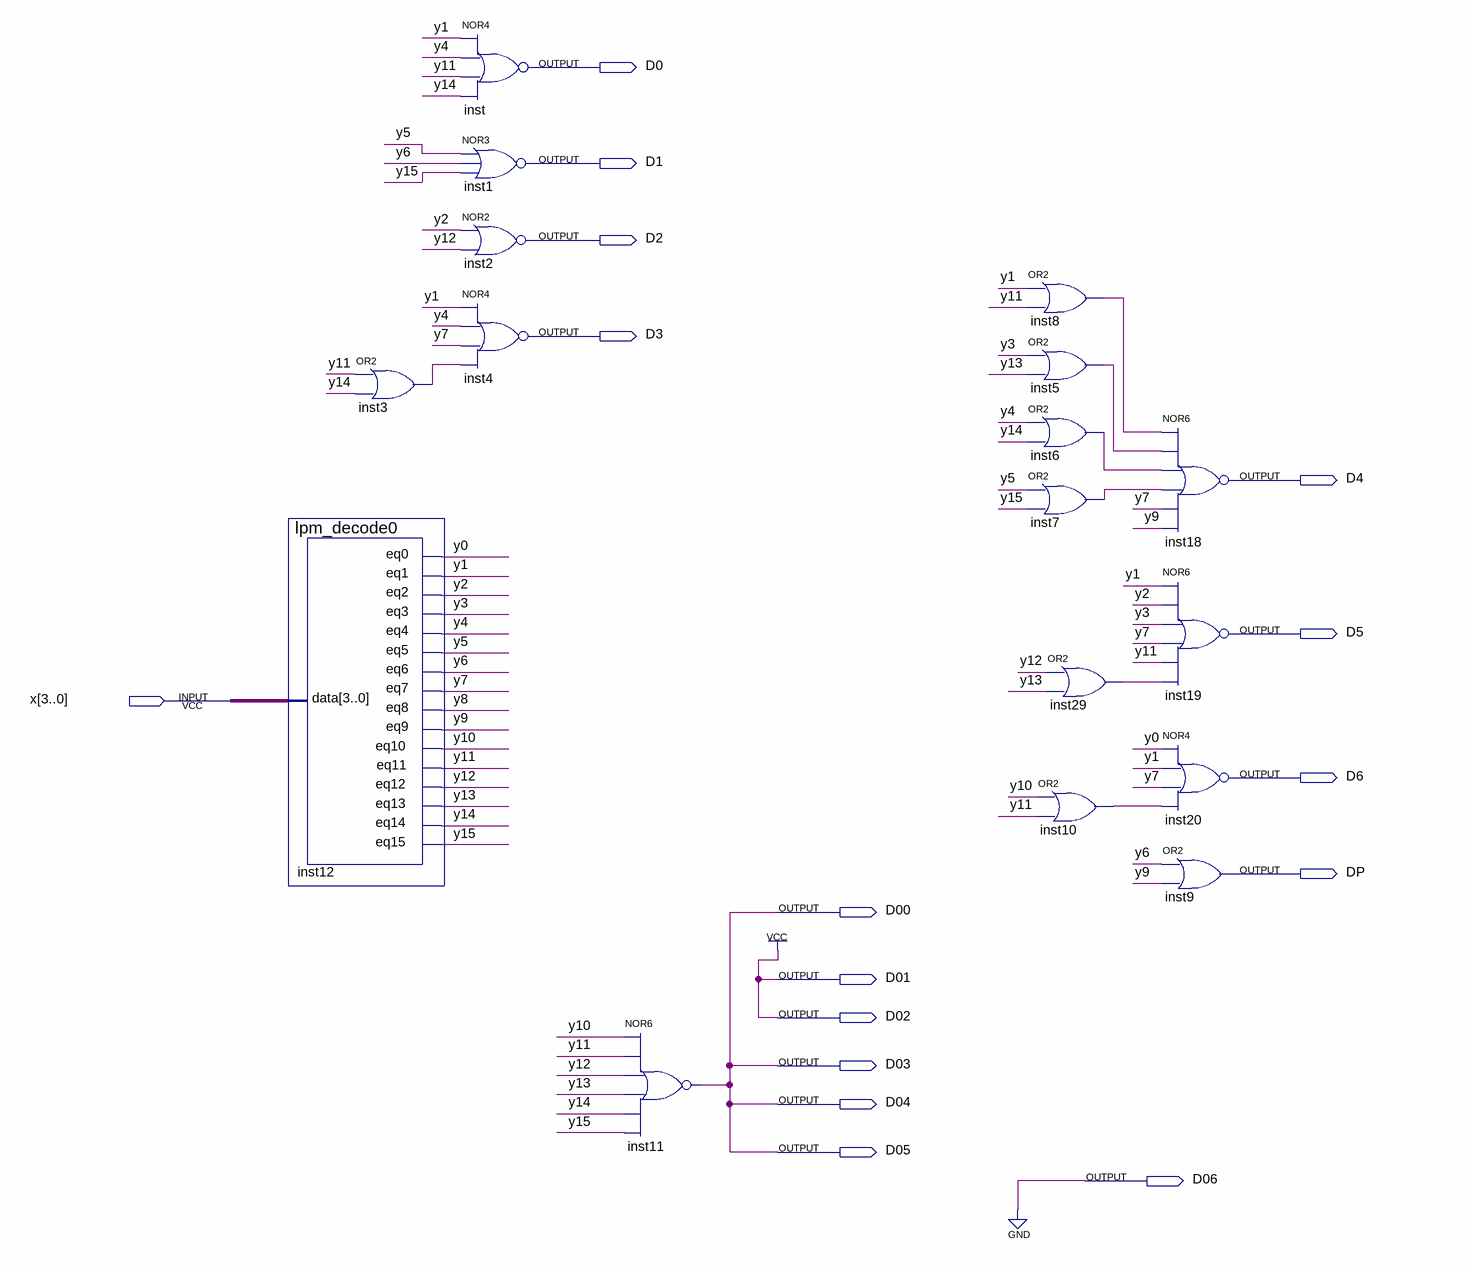
[diagram p0: schematic sheet]
// Quartus schematic clock_face.bdf as structural Verilog: 17 symbols, 16 pins
module clock_face (
  input  [3:0] x,
  output D0,
  output D1,
  output D2,
  output D3,
  output D4,
  output D5,
  output D6,
  output DP,
  output D00,
  output D01,
  output D02,
  output D03,
  output D04,
  output D05,
  output D06
);

  wire inst3_out, inst5_out, inst6_out, inst7_out, inst8_out, inst10_out, inst29_out, y0, y1, y2, y3, y4, y5,
       y6, y7, y8, y9, y10, y11, y12, y13, y14, y15;

  or inst3 (inst3_out, y11, y14);
  lpm_decode0 inst12 (
    .data(x), .eq0(y0), .eq1(y1), .eq2(y2), .eq3(y3), .eq4(y4), .eq5(y5), .eq6(y6), .eq7(y7), .eq8(y8),
    .eq9(y9), .eq10(y10), .eq11(y11), .eq12(y12), .eq13(y13), .eq14(y14), .eq15(y15));
  nor inst (D0, y1, y4, y11, y14);
  nor inst1 (D1, y5, y6, y15);
  nor inst2 (D2, y2, y12);
  nor inst4 (D3, y1, y4, y7, inst3_out);
  nor inst11 (D00, y10, y11, y12, y13, y14, y15);
  or inst8 (inst8_out, y1, y11);
  or inst5 (inst5_out, y3, y13);
  or inst6 (inst6_out, y4, y14);
  or inst7 (inst7_out, y5, y15);
  or inst29 (inst29_out, y12, y13);
  or inst10 (inst10_out, y10, y11);
  nor inst18 (D4, inst8_out, inst5_out, inst6_out, inst7_out, y7, y9);
  nor inst19 (D5, y1, y2, y3, y7, y11, inst29_out);
  nor inst20 (D6, y0, y1, y7, inst10_out);
  or inst9 (DP, y6, y9);

  assign D01 = 1'b1;
  assign D02 = 1'b1;
  assign D03 = D00;
  assign D04 = D00;
  assign D05 = D00;
  assign D06 = 1'b0;
endmodule
